# EAGLE schematic RFID Reader PCB (EAGLE 5.02)
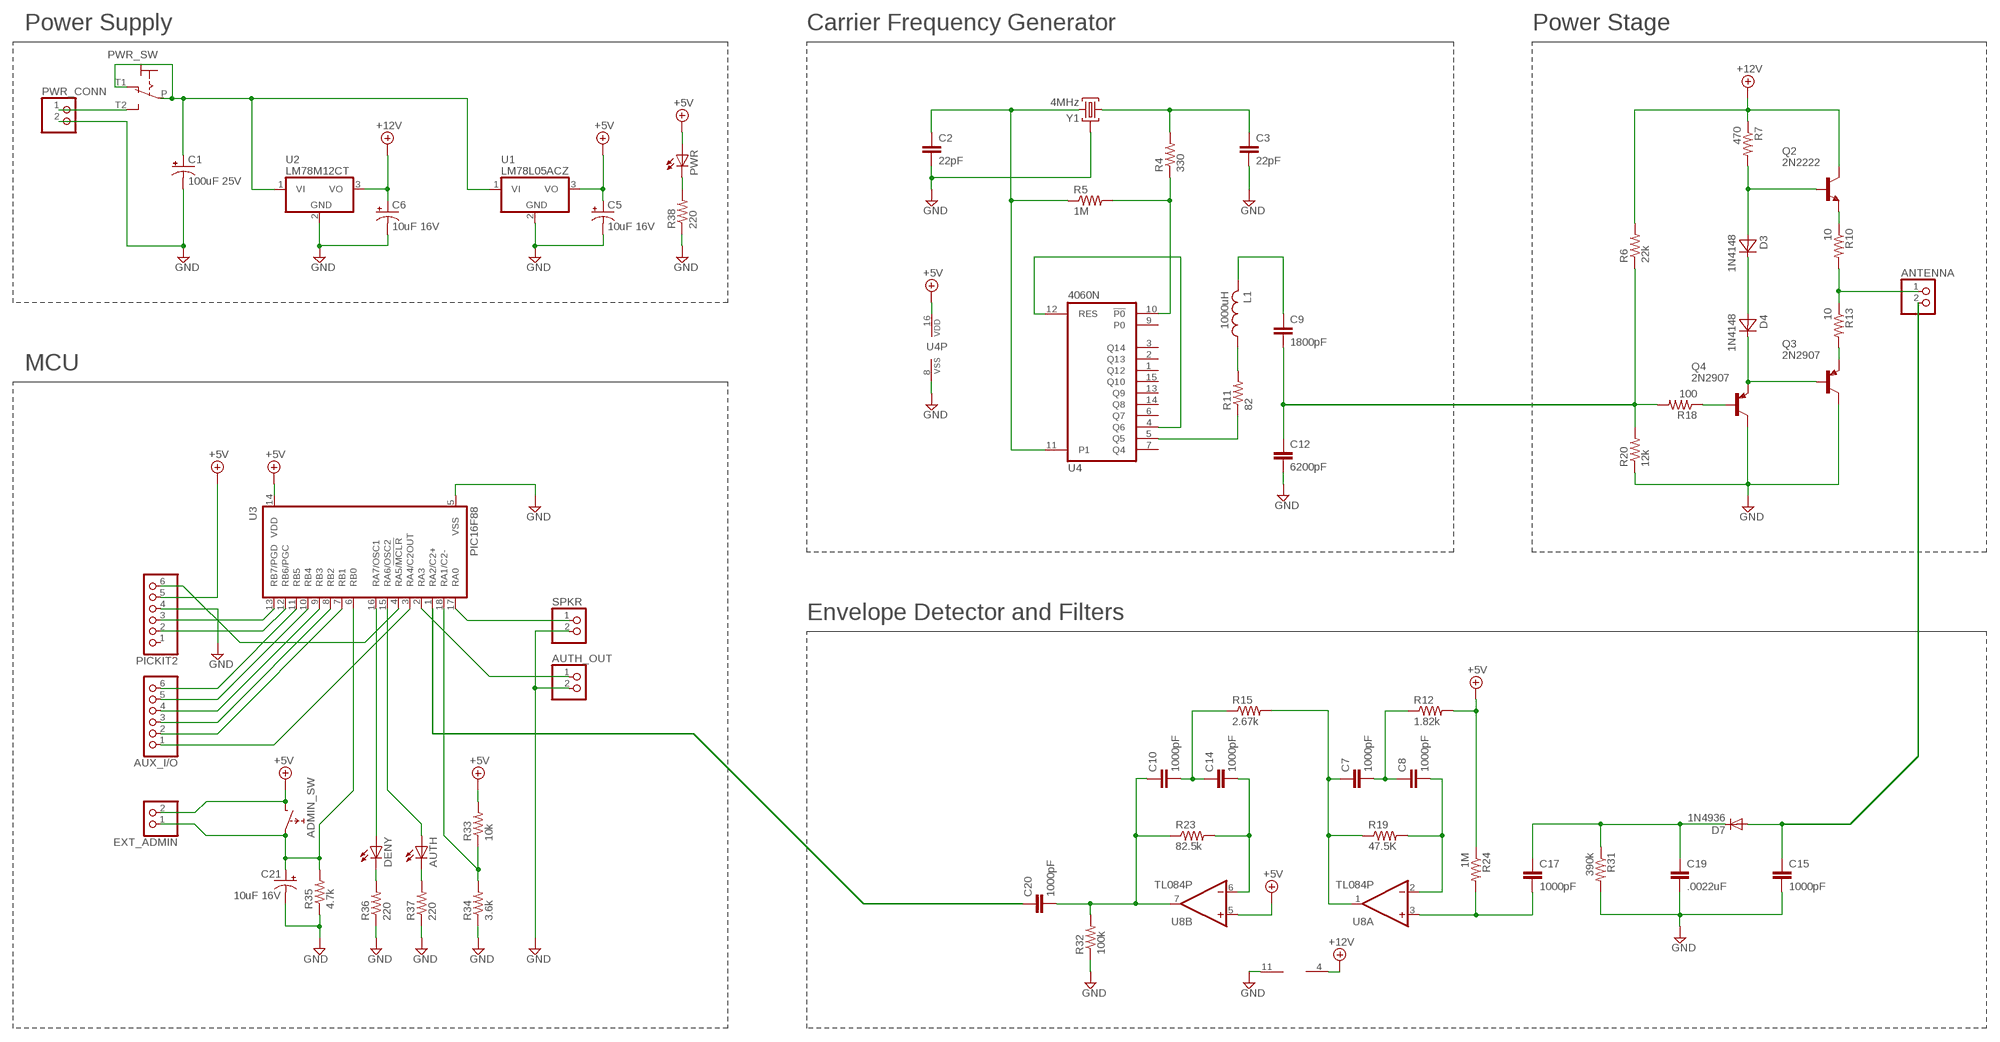
[diagram p0: schematic, sheet 1]

## Parts
ADMIN_SW  SWITCH  [PUSH_SW]
ANTENNA  PINHD-1X2  [1X02]
AUTH  LED  [C1210]
AUTH_OUT  PINHD-1X2  [1X02]
AUX_I/O  PINHD-1X6  [1X06]
C1  100uF 25V  CPOL2D6  [TT2D6]
C2  22pF  C635  [CER6.35]
C3  22pF  C635  [CER6.35]
C5  10uF 16V  CPOL2D4  [TT2D4]
C6  10uF 16V  CPOL2D4  [TT2D4]
C7  1000pF  C6102  [C102-040X125]
C8  1000pF  C6102  [C102-040X125]
C9  1800pF  C2444  [C025-024X044]
C10  1000pF  C6102  [C102-040X125]
C12  6200pF  C86  [C050-025X050]
C14  1000pF  C6102  [C102-040X125]
C15  1000pF  C370  [C050-025X075]
C17  1000pF  C370  [C050-025X075]
C19  .0022uF  C370  [C050-025X075]
C20  1000pF  C370  [C050-025X075]
C21  10uF 16V  CPOL2D4  [TT2D4]
D3  1N4148  [DO35-4]
D4  1N4148  [DO35-4]
D7  1N4936  [DO41-10]
DENY  LED  [C1210]
EXT_ADMIN  PINHD-1X2  [1X02]
L1  1000uH  L  [0208/7]
PICKIT2  PINHD-1X6  [1X06]
PWR  LED  [C1210]
PWR_CONN  PINHD-1X2  [1X02]
PWR_SW  TOGGLE_SWITCH  [TOGL_SW]
Q2  2N2222  [TO92-CBE]
Q3  2N2907  [TO92-EBC]
Q4  2N2907  [TO92-EBC]
R4  330  R  [0207/7]
R5  1M  R  [0207/7]
R6  22k  R  [0207/7]
R7  470  R  [0207/7]
R10  10  R  [0207/7]
R11  82  R  [0207/7]
R12  1.82k  R  [0207/7]
R13  10  R  [0207/7]
R15  2.67k  R  [0207/7]
R18  100  R  [0207/7]
R19  47.5K  R  [0207/7]
R20  12k  R  [0207/7]
R23  82.5k  R  [0207/7]
R24  1M  R  [0207/7]
R31  390k  R  [0207/7]
R32  100k  R  [0207/7]
R33  10k  R  [0207/7]
R34  3.6k  R  [0207/7]
R35  4.7k  R  [0207/7]
R36  220  R  [0207/7]
R37  220  R  [0207/7]
R38  220  R  [0207/7]
SPKR  PINHD-1X2  [1X02]
U1  LM78L05ACZ  [TO92-]
U2  LM78M12CT  [TO220V]
U3  PIC16F88  [DIL18]
U4  4060N  [DIL16]
U8  TL084P  [DIL14]
Y1  4MHz  CRYSTAL  [RAD3LEAD]

## Nets
+5V: ADMIN_SW.2 C5.+ EXT_ADMIN.2 PICKIT2.5 PWR.A R12.2 R24.1 R33.2 U1.3(VO) U3.14(VDD) U4.16(VDD) U8.5(B:+IN)
+12V: C6.+ Q2.C R6.2 R7.1 U2.3(VO) U8.4(P:V+)
GND: AUTH_OUT.2 C1.- C2.2 C3.2 C5.- C6.- C12.2 C15.2 C19.2 C21.- PICKIT2.4 PWR_CONN.2 Q3.C Q4.C R20.1 R31.2 R32.1 R34.1 R35.1 R36.1 R37.1 R38.1 SPKR.2 U1.2(GND) U2.2(GND) U3.5(VSS) U4.8(VSS) U8.11(P:V-) Y1.2
N$1: C2.1 R5.1 U4.11(P1) Y1.3
N$2: C3.1 R4.2 Y1.1
N$3: U4.4(Q6) U4.12(RES)
N$4: R4.1 R5.2 U4.10(!P0)
N$5: L1.1 R11.2
N$6: R11.1 U4.5(Q5)
N$7: C9.1 L1.2
N$8: C9.2 C12.1 R6.1 R18.2 R20.2
N$9: ANTENNA.2 C15.1 D7.A
N$10: Q2.E R10.1
N$11: ANTENNA.1 R10.2 R13.1
N$12: Q3.E R13.2
N$13: D3.A Q2.B R7.2
N$14: D3.C D4.A
N$15: D4.C Q3.B Q4.E
N$16: Q4.B R18.1
N$17: C14.2 R23.2 U8.6(B:-IN)
N$18: C17.1 C19.1 D7.C R31.1
N$19: DENY.C R36.2
N$20: C17.2 R24.2 U8.3(A:+IN)
N$21: C10.2 C14.1 R15.1
N$22: C10.1 C20.2 R23.1 R32.2 U8.7(B:OUT)
N$23: C8.2 R19.2 U8.2(A:-IN)
N$24: C7.1 R15.2 R19.1 U8.1(A:OUT)
N$25: C7.2 C8.1 R12.1
N$26: AUTH.C R37.2
N$27: AUTH.A U3.15(RA6/OSC2)
N$28: R33.1 R34.2 U3.18(RA1/C2-)
N$29: PWR.C R38.2
N$30: DENY.A U3.16(RA7/OSC1)
N$31: PICKIT2.2 U3.12(RB6/PGC)
N$32: ADMIN_SW.1 C21.+ EXT_ADMIN.1 R35.2 U3.6(RB0)
N$33: PICKIT2.6 U3.4(RA5/!MCLR)
N$34: PICKIT2.3 U3.13(RB7/PGD)
N$35: AUX_I/O.1 U3.3(RA4/C2OUT)
N$36: AUX_I/O.2 U3.7(RB1)
N$37: AUX_I/O.3 U3.8(RB2)
N$38: AUX_I/O.4 U3.9(RB3)
N$39: AUX_I/O.5 U3.10(RB4)
N$40: AUX_I/O.6 U3.11(RB5)
N$41: C20.1 U3.1(RA2/C2+)
N$42: PWR_CONN.1 PWR_SW.T2
N$43: SPKR.1 U3.17(RA0)
N$44: AUTH_OUT.1 U3.2(RA3)
SUPPLY: C1.+ PWR_SW.P PWR_SW.T1 U1.1(VI) U2.1(VI)
Unconnected: PICKIT2.1 U4.1(Q12) U4.2(Q13) U4.3(Q14) U4.6(Q7) U4.7(Q4) U4.9(P0) U4.13(Q9) U4.14(Q8) U4.15(Q10) U8.8(C:OUT) U8.9(C:-IN) U8.10(C:+IN) U8.12(D:+IN) U8.13(D:-IN) U8.14(D:OUT)

## Notes on the sheet
- Power Supply | Carrier Frequency Generator | Power Stage
- MCU
- Envelope Detector and Filters

## Library data of the parts
ADMIN_SW = RFID Reader Part Library:SWITCH
ANTENNA AUTH_OUT EXT_ADMIN PWR_CONN SPKR = RFID Reader Part Library:PINHD-1X2: PIN HEADER
AUTH DENY PWR = RFID Reader Part Library:LED
AUX_I/O PICKIT2 = RFID Reader Part Library:PINHD-1X6: PIN HEADER
C1 C5 C6 C21 = RFID Reader Part Library:CPOL
C2 C3 C7-C10 C12 C14 C15 C17 C19 C20 = RFID Reader Part Library:C
D3 D4 = RFID Reader Part Library:1N4148
D7 = RFID Reader Part Library:1N4936: DIODE fast recovery rectifier, 1A
L1 = RFID Reader Part Library:L
PWR_SW = RFID Reader Part Library:TOGGLE_SWITCH
Q2 = RFID Reader Part Library:2N2222*: NPN Transistor
Q3 Q4 = RFID Reader Part Library:2N2907*: PNP Transistor
R4-R7 R10-R13 R15 R18-R20 R23 R24 R31-R38 = RFID Reader Part Library:R
U1 = RFID Reader Part Library:LM78L05
U2 = RFID Reader Part Library:LM78M12: Positive VOLTAGE REGULATOR Source: http://www.national.com/ds/LM/LM341.pdf
U3 = RFID Reader Part Library:PIC16F88: MICROCONTROLLER 8-Bit PIC16F8X Family - CMOS Flash/EEPROM Pin Compatible : PIC16F83, PIC16CR83, PIC16F84A, PIC16CR84 see also PIC16C*
U4 = RFID Reader Part Library:4060: 14-stage binary/ripple COUNTER
U8 = RFID Reader Part Library:TL084: OP AMP
Y1 = RFID Reader Part Library:CRYSTAL

## Net classes
0 default: width 0.508 mm